# EAGLE schematic interstage_A1v2 (EAGLE 9.6.1)
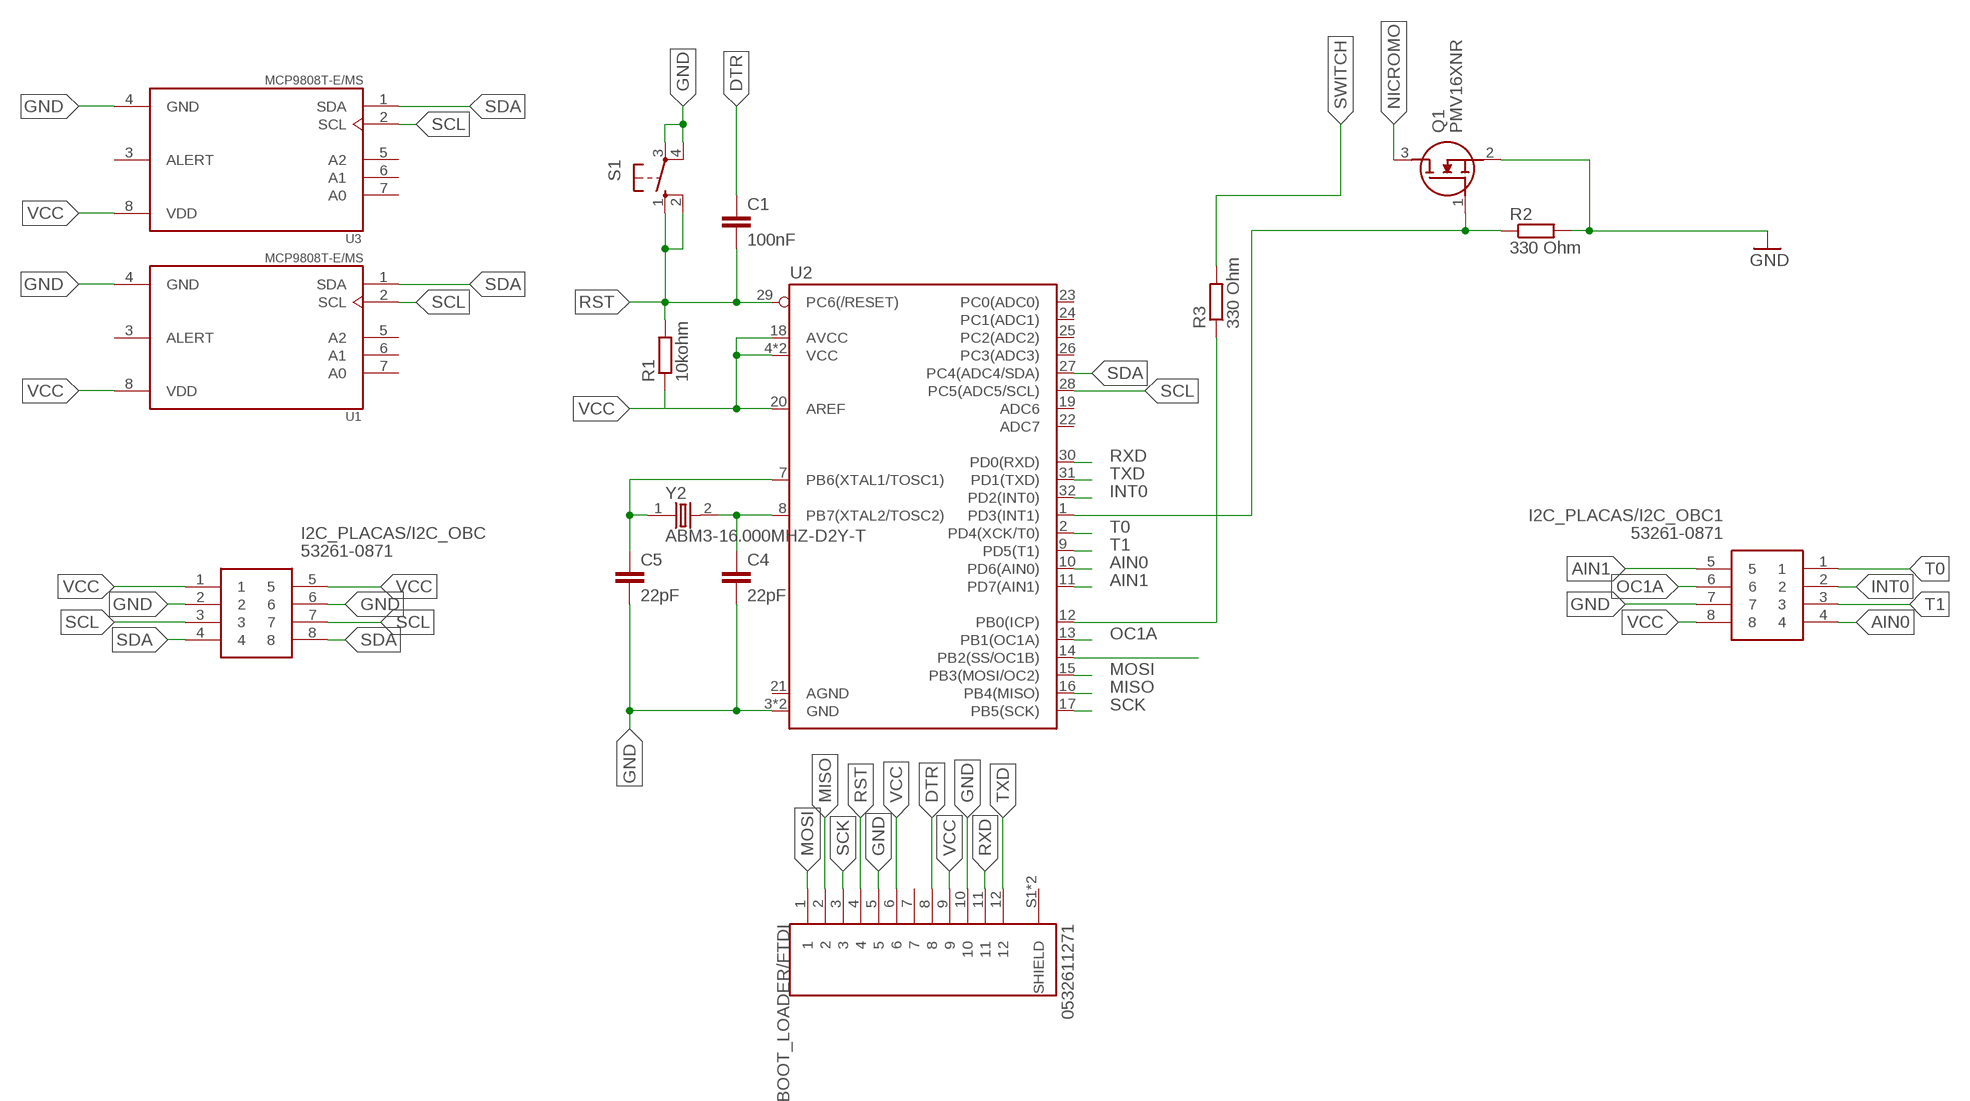
[diagram p0: schematic, sheet 1]

## Parts
BOOT_LOADER/FTDI  0532611271  [MOLEX_0532611271]
C1  100nF  C-EUC0805K  [C0805K]
C4  22pF  C-EUC0603K  [C0603K]
C5  22pF  C-EUC0603K  [C0603K]
I2C_PLACAS/I2C_OBC  53261-0871  [53261-0871]
I2C_PLACAS/I2C_OBC1  53261-0871  [53261-0871]
Q1  PMV16XNR  [SOT95P230X110-3N]
R1  10kohm  R-EU_R1206  [R1206]
R2  330 Ohm  R-EU_R1206  [R1206]
R3  330 Ohm  R-EU_R1206  [R1206]
S1  10-XX  [B3F-10XX]
U1  MCP9808T-E/MS  [SOP65P490X110-8N]
U2  ATMEGA328P_TQFP  [TQFP32-08]
U3  MCP9808T-E/MS  [SOP65P490X110-8N]
Y2  ABM3-16.000MHZ-D2Y-T  [XTAL500X320X130N]

## Nets
AIN0: I2C_PLACAS/I2C_OBC1.4 U2.10(PD6(AIN0))
AIN1: I2C_PLACAS/I2C_OBC1.5 U2.11(PD7(AIN1))
DTR: BOOT_LOADER/FTDI.8 C1.1
GND: BOOT_LOADER/FTDI.5 BOOT_LOADER/FTDI.10 C4.2 C5.2 I2C_PLACAS/I2C_OBC1.7 I2C_PLACAS/I2C_OBC.2 I2C_PLACAS/I2C_OBC.6 Q1.2(S) R2.2 S1.3(P) S1.4(P1) U1.4(GND) U2.3(GND) U2.5(GND) U3.4(GND)
ICP: R3.1 U2.12(PB0(ICP))
INT0: I2C_PLACAS/I2C_OBC1.2 U2.32(PD2(INT0))
INT1: Q1.1(G) R2.1 U2.1(PD3(INT1))
MISO: BOOT_LOADER/FTDI.2 U2.16(PB4(MISO))
MOSI: BOOT_LOADER/FTDI.1 U2.15(PB3(MOSI/OC2))
N$1: C5.1 U2.7(PB6(XTAL1/TOSC1)) Y2.1
N$2: C4.1 U2.8(PB7(XTAL2/TOSC2)) Y2.2
N$6: U2.14(PB2(SS/OC1B))
NICROMO: Q1.3(D)
OC1A: I2C_PLACAS/I2C_OBC1.6 U2.13(PB1(OC1A))
RST: BOOT_LOADER/FTDI.4 C1.2 R1.2 S1.1(S) S1.2(S1) U2.29(PC6(/RESET))
RXD: BOOT_LOADER/FTDI.11 U2.30(PD0(RXD))
SCK: BOOT_LOADER/FTDI.3 U2.17(PB5(SCK))
SCL: I2C_PLACAS/I2C_OBC.3 I2C_PLACAS/I2C_OBC.7 U1.2(SCL) U2.28(PC5(ADC5/SCL)) U3.2(SCL)
SDA: I2C_PLACAS/I2C_OBC.4 I2C_PLACAS/I2C_OBC.8 U1.1(SDA) U2.27(PC4(ADC4/SDA)) U3.1(SDA)
SWITCH: R3.2
T0: I2C_PLACAS/I2C_OBC1.1 U2.2(PD4(XCK/T0))
T1: I2C_PLACAS/I2C_OBC1.3 U2.9(PD5(T1))
TXD: BOOT_LOADER/FTDI.12 U2.31(PD1(TXD))
VCC: BOOT_LOADER/FTDI.6 BOOT_LOADER/FTDI.9 I2C_PLACAS/I2C_OBC1.8 I2C_PLACAS/I2C_OBC.1 I2C_PLACAS/I2C_OBC.5 R1.1 U1.8(VDD) U2.4(VCC) U2.6(VCC) U2.18(AVCC) U2.20(AREF) U3.8(VDD)
Unconnected: BOOT_LOADER/FTDI.7 BOOT_LOADER/FTDI.S1(SHIELD) BOOT_LOADER/FTDI.S2(SHIELD) U1.3(ALERT) U1.5(A2) U1.6(A1) U1.7(A0) U2.19(ADC6) U2.21(AGND) U2.22(ADC7) U2.23(PC0(ADC0)) U2.24(PC1(ADC1)) U2.25(PC2(ADC2)) U2.26(PC3(ADC3)) U3.3(ALERT) U3.5(A2) U3.6(A1) U3.7(A0)

## Library data of the parts
BOOT_LOADER/FTDI = picoblade:0532611271: Conn Shrouded Header HDR 12 POS 1.25mm Solder RA SMD PicoBlade; AVAILABILITY: Unavailable; DESCRIPTION: Picoblade Connector, 12 Circuit Single Row, Right Angle Surface Mount SMT PCB; MF: Molex; MP: 0532611271; PACKAGE: None; PRICE: None
C1 C4 C5 = rcl:C-EU: CAPACITOR, European symbol; SPICEPREFIX: C
I2C_PLACAS/I2C_OBC I2C_PLACAS/I2C_OBC1 = SamacSys_Parts:53261-0871: Molex PICOBLADE Series, Series Number 53261, 1.25mm Pitch, 8 Way 1 Row Shrouded Right Angle PCB Header, Surface Mount Source: Datasheet <http://www.molex.com/webdocs/datasheets/pdf/en-us/0532610871_PCB_HEADERS.pdf>; DESCRIPTION: Molex PICOBLADE Series, Series Number 53261, 1.25mm Pitch, 8 Way 1 Row Shrouded Right Angle PCB Header, Surface Mount; HEIGHT: mm; MANUFACTURER_NAME: Molex; MANUFACTURER_PART_NUMBER: 53261-0871; MOUSER_PART_NUMBER: 538-53261-0871; MOUSER_PRICE-STOCK: https://www.mouser.co.uk/ProductDetail/Molex/53261-0871?qs=%252B72YyncTwW%252BggfdCJ7Netw%3D%3D
Q1 = SamacSys_Parts:PMV16XNR: Nexperia PMV16XNR N-channel MOSFET, 8.6 A, 20 V PMV16XN, 3-Pin SOT-23 Source: Datasheet <https://componentsearchengine.com/Datasheets/1/PMV16XNR.pdf>; DESCRIPTION: Nexperia PMV16XNR N-channel MOSFET, 8.6 A, 20 V PMV16XN, 3-Pin SOT-23; HEIGHT: 1.1mm; MANUFACTURER_NAME: Nexperia; MANUFACTURER_PART_NUMBER: PMV16XNR; MOUSER_PART_NUMBER: 771-PMV16XNR; MOUSER_PRICE-STOCK: https://www.mouser.com/Search/Refine.aspx?Keyword=771-PMV16XNR
R1-R3 = rcl:R-EU_: RESISTOR, European symbol; SPICEPREFIX: R
S1 = switch-omron:10-XX: OMRON SWITCH; MPN: B3F-1000; OC_FARNELL: 176432; OC_NEWARK: 36M3542
U1 U3 = sensorSPEL:MCP9808T-E/MS: Board Mount Temperature Sensors Silicon temp sensor with I2C interface; DESCRIPTION: Temperature Sensor Digital, Local -40°C ~ 125°C 10 b 8-MSOP; DIGI-KEY_PART_NUMBER: MCP9808T-E/MSCT-ND; MF: Microchip; MP: MCP9808T-E/MS; PACKAGE: MSOP-8 Microchip
U2 = SparkFun-IC-Microcontroller:ATMEGA328P_TQFP: Popular 328P in QFP Storefront component: ATmega328 - TQFP <https://www.sparkfun.com/products/13448> (COM-13448) Datasheet <http://www.sparkfun.com/datasheets/Components/SMD/ATMega328.pdf> SparkFun Products SparkFun RedBoard - Programmed with Arduino <https://www.sparkfun.com/products/12757> (DEV-12757) Arduino Pro Mini 328 - 5V/16MHz <https://www.sparkfun.com/products/11113> (DEV-11113) Arduino Pro Mini 328 - 3.3V/8MHz <https://www.sparkfun.com/products/11114> (DEV-11114) SparkFun OpenLog <https://www.sparkfun.com/products/13712> (DEV-13712) SparkFun MicroView - OLED Arduino Module <https://www.sparkfun.com/products/12923> (DEV-12923) SparkFun Digital Sandbox <https://www.sparkfun.com/products/12651> (DEV-12651) SparkFun PicoBoard <https://www.sparkfun.com/products/11888> (WIG-11888) Arduino Fio <https://www.sparkfun.com/products/10116> (DEV-10116) LilyPad Arduino 328 Main Board <https://www.sparkfun.com/products/13342> (DEV-13342) SparkFun RedStick <https://www.sparkfun.com/products/13741> (DEV-13741) LilyPad MP3 <https://www.sparkfun.com/products/11013> (DEV-11013) LilyPad Arduino SimpleSnap <https://www.sparkfun.com/products/10941> (DEV-10941) SparkFun Stepoko <https://www.sparkfun.com/products/13899> (ROB-13899) SparkFun Geiger Counter <https://www.sparkfun.com/products/11345> (SEN-11345) SparkFun EL Sequencer <https://www.sparkfun.com/products/12781> (COM-12781) Arduino Pro 328 - 5V/16MHz <https://www.sparkfun.com/products/10915> (DEV-10915) CryptoCape <https://www.sparkfun.com/products/12773> (DEV-12773) SparkFun IR Thermometer Evaluation Board - MLX90614 <https://www.sparkfun.com/products/10740> (SEN-10740) SparkFun RedBot Mainboard <https://www.sparkfun.com/products/12097> (ROB-12097) Arduino Pro 328 - 3.3V/8MHz <https://www.sparkfun.com/products/10914> (DEV-10914) SparkFun Block for Intel® Edison - Arduino <https://www.sparkfun.com/products/13036> (DEV-13036) SparkFun Simon Says - Surface Mount Soldering Kit <https://www.sparkfun.com/products/10935> (KIT-10935) SparkFun 7-Segment Serial Display - Red <https://www.sparkfun.com/products/11441> (COM-11441) SparkFun 7-Segment Serial Display - White <https://www.sparkfun.com/products/11629> (COM-11629) SparkFun 7-Segment Serial Display - Yellow <https://www.sparkfun.com/products/11443> (COM-11443) SparkFun 7-Segment Serial Display - Kelly Green <https://www.sparkfun.com/products/11440> (COM-11440) SparkFun 7-Segment Serial Display - Blue <https://www.sparkfun.com/products/11442> (COM-11442) SparkFun OpenSegment Serial Display - 20mm (Blue) <https://www.sparkfun.com/products/11647> (COM-11647) SparkFun OpenSegment Serial Display - 20mm (Green) <https://www.sparkfun.com/products/11646> (COM-11646) SparkFun OpenSegment Serial Display - 20mm (White) <https://www.sparkfun.com/products/11648> (COM-11648) SparkFun OpenSegment Serial Display - 20mm (Red) <https://www.sparkfun.com/products/11644> (COM-11644) SparkFun OpenSegment Serial Display - 20mm (Yellow) <https://www.sparkfun.com/products/11645> (COM-11645) SparkFun OpenSegment Shield <https://www.sparkfun.com/products/13190> (DEV-13190); PROD_ID: IC-09069
Y2 = ABM3-16.000MHZ-D2Y-T:ABM3-16.000MHZ-D2Y-T: Crystals 12MHz 18pF 30ppm -40C +85C; DESCRIPTION: 16MHz ±20ppm Crystal 18pF 40 Ohms 2-SMD, No Lead; DIGI-KEY_PART_NUMBER: 535-10638-1-ND; DIGIKEY-PURCHASE-URL: https://snapeda.com/shop?store=DigiKey&id=55267; MF: Abracon; MP: ABM3-16.000MHZ-D2Y-T; PACKAGE: SMD-2 Abracon